# Altium project DD_Current_Sensing_Vedha.PrjPcb
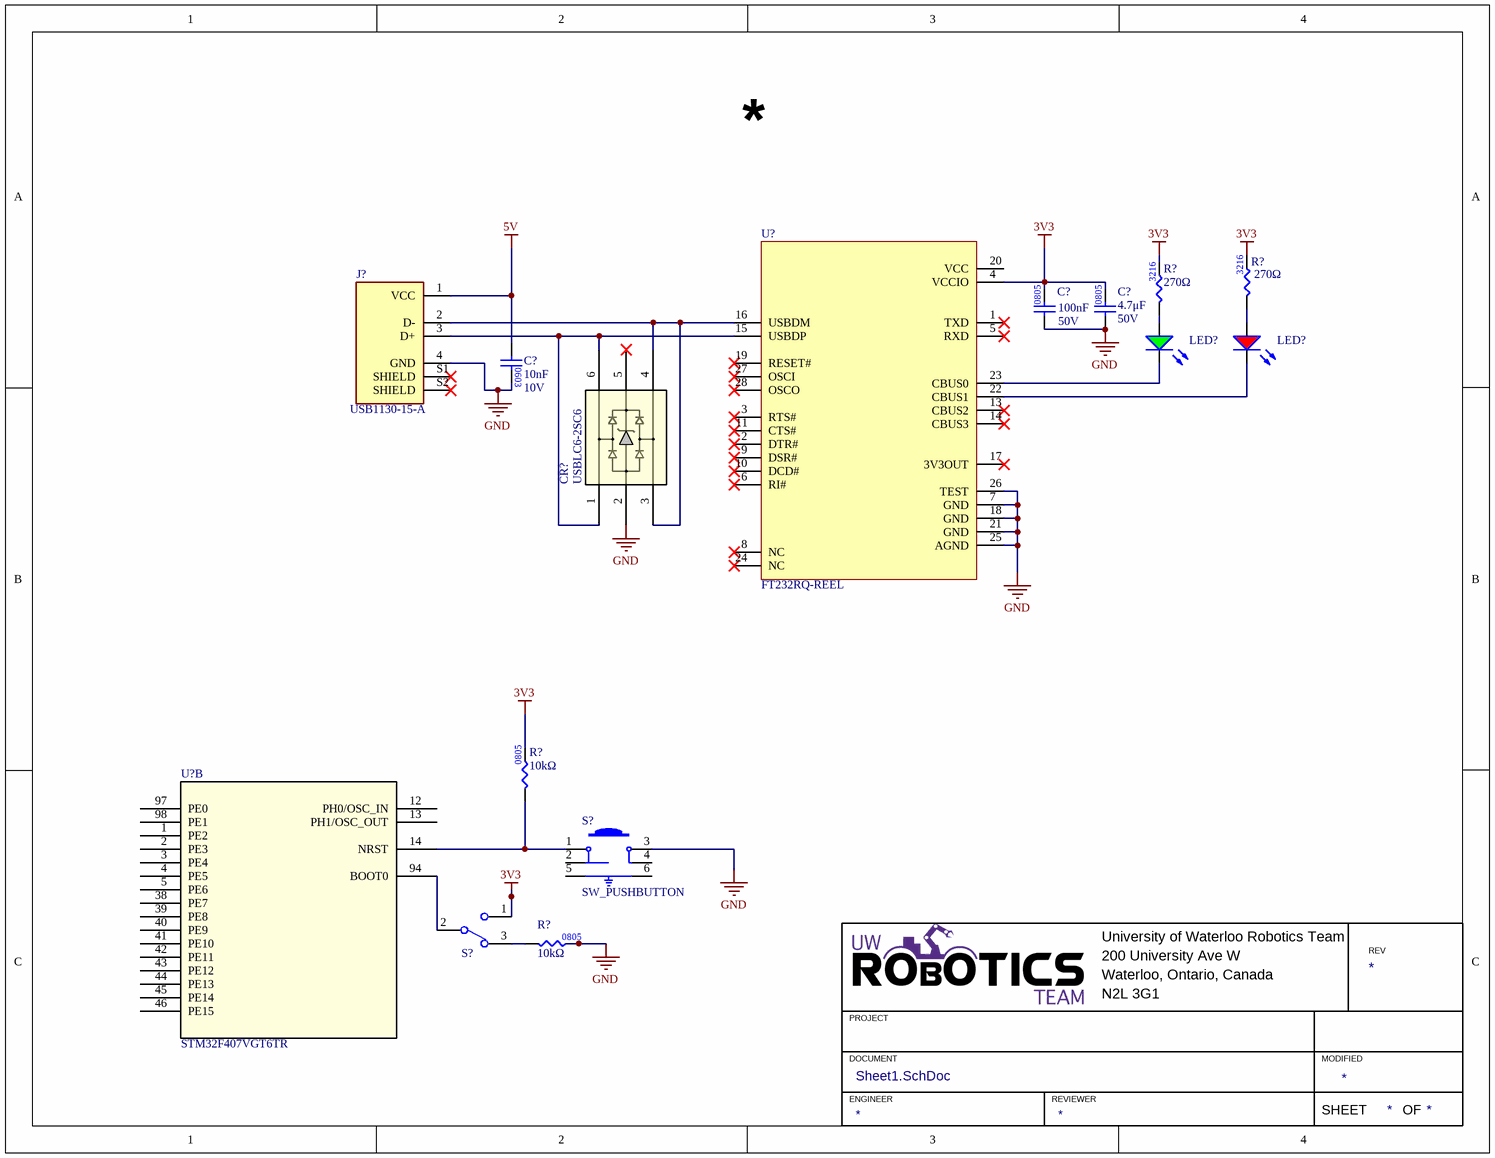
[diagram p0: Sheet1.SchDoc]
designer: Logan Hartford; reviewer: Ari Wasch; total sheets: 6; version: 6.0
5 sheets, 75 parts. Net scope: global (net labels, ports and power ports of the same name join across sheets).
Sheets:
  Sheet1.SchDoc
  Sheet2.SchDoc
  buck_converter.SchDoc
  Sheet3.SchDoc
  5V_to_3V3_Regulator.SchDoc

## Sheet Sheet1.SchDoc
size 279 x 215 mm

### Parts
(Parts that share a designator on the sheet are numbered #1, #2 ... from top to bottom, then left to right.)
C?#1  value 100nF  Voltage Rating: 50V  [CAP0805]  (hidden comment: CAP_100nF_50V_0805)
C?#2  value 4.7μF  Voltage Rating: 50V  [CAP0805]  (hidden comment: CAP_4.7uF_50V_0805)
C?#3  value 10nF  Voltage Rating: 10V  [CAP0603]  (hidden comment: CAP_10nF_25V_0603)
CR?  USBLC6-2SC6  [SOT23-6L_STM]
J?  Manufacturer Part Number 1: USB1130-15-A  [USB-A 2.0 Connector - 3d ver]  (hidden comment: USB-A 2.0 Connector)
LED?#1  LED_RED  [LED_0805_RED]  (value not drawn)
LED?#2  LED_GREEN  [LED_0805_GREEN]  (value not drawn)
R?#1  value 270Ω  [RES1206]  (hidden comment: Res_270_Ohms)
R?#2  value 270Ω  [RES1206]  (hidden comment: Res_270_Ohms)
R?#3  value 10kΩ  [RES0805]  (hidden comment: RES_10kΩ_0805_5%)
R?#4  value 10kΩ  [RES0805]  (hidden comment: RES_10kΩ_0805_5%)
S?#1  SW_PUSHBUTTON  [TACTILE_SWITCH_SMD]
S?#2  SW_TOGGLE_SPDT  [100SP1T1B4M2QE]  (value not drawn)
U?#1  FT232RQ-REEL  [FT232RQ-REEL_FTD]
U?#2  STM32F407VGT6TR  [LQFP100-14x14mm]  (part B of 3)

### Nets
3V3: C?#1.2 C?#2.2 R?#1.2 R?#2.2 R?#3.2 S?#2.1 U?#1.4(VCCIO)
5V: C?#3.1 J?.1(VCC)
GND: C?#1.1 C?#2.1 C?#3.2 CR?.2 J?.4(GND) R?#4.2 S?#1.3 U?#1.7(GND) U?#1.18(GND) U?#1.21(GND) U?#1.25(AGND) U?#1.26(TEST)
NetCR?_1: CR?.1 CR?.6 J?.3(D+) U?#1.15(USBDP)
NetCR?_3: CR?.3 CR?.4 J?.2(D-) U?#1.16(USBDM)
NetLED?#1_1: LED?#1.1(A) R?#1.1
NetLED?#1_2: LED?#1.2(K) U?#1.22(CBUS1)
NetLED?#2_1: LED?#2.1(A) R?#2.1
NetLED?#2_2: LED?#2.2(K) U?#1.23(CBUS0)
NetR?#3_1: R?#3.1 S?#1.1 U?#2.14(NRST)
NetR?#4_1: R?#4.1 S?#2.3
NetS?#2_2: S?#2.2 U?#2.94(BOOT0)

Not connected (* = marked no-connect by the designer): CR? 5*; J? S1(SHIELD)* S2(SHIELD)*; S?#1 2 4 5 6; U?#1 1(TXD)* 2(DTR#)* 3(RTS#)* 5(RXD)* 6(RI#)* 8(NC)* 9(DSR#)* 10(DCD#)* 11(CTS#)* 13(CBUS2)* 14(CBUS3)* 17(3V3OUT)* 19(RESET#)* 20(VCC) 24(NC)* 27(OSCI)* 28(OSCO)*; U?#2 1(PE2) 2(PE3) 3(PE4) 4(PE5) 5(PE6) 12(PH0/OSC_IN) 13(PH1/OSC_OUT) 38(PE7) 39(PE8) 40(PE9) 41(PE10) 42(PE11) 43(PE12) 44(PE13) 45(PE14) 46(PE15) 97(PE0) 98(PE1)

### Notes on the sheet
- University of Waterloo Robotics Team
- 200 University Ave W
- REV
- PROJECT
- Waterloo, Ontario, Canada
- N2L 3G1
- DOCUMENT
- ENGINEER
- REVIEWER
- MODIFIED
- SHEET
- OF
- (in symbol CAP_10nF_25V_0603) 0603
- (in symbol Res_270_Ohms) 3216

### Library data of the parts
C?#1 = CAP_100nF_50V_0805: CAP CER 0.1UF 50V X7R 0805; Manufacturer 1: Samsung Electro-Mechanics; Manufacturer Part Number 1: CL21B104KBCNNNC; Package/Footprint: 0805; Supplier 1: Digi-Key; Supplier Part Number 1: 1276-1003-1-ND
C?#2 = CAP_4.7uF_50V_0805: CAP CER 4.7UF 50V X5R 0805; Manufacturer 1: TDK Corporation; Manufacturer Part Number 1: CGA4J3X5R1H475K125AB; Mounting Type: SMD; Supplier 1: Digi-Key; Supplier Part Number 1: 445-7882-1-ND; Package: 0805; LCSC Part #: C1779; Dielectric: X5R
C?#3 = CAP_10nF_25V_0603: CAP CER 10000PF 25V C0G 0603; Manufacturer Part Number 1: C1608C0G1E103J080AA; Manufacturer 1: Yageo; Supplier Part Number 1: 445-2664-1-ND; Supplier 1: Digi-Key; Dielectric: C0G
CR? = USBLC6-2SC6: 17V Clamp 5A (8/20µs) Ipp Tvs Diode Surface Mount SOT-23-6; Mfr_Name: STMicroelectronics; RefDes: RefDes; Type: Type; Supplier 1: Mouser; Supplier Part Number 1: 511-USBLC6-2SC6
J? = USB-A 2.0 Connector: USB-A (USB TYPE-A) USB 2.0 Receptacle Connector 4 Position Through Hole, Right Angle; Manufacturer 1: GCT; Supplier 1: Digi-Key; Supplier Part Number 1: 2073-USB1130-15-ACT-ND
LED?#1 = LED_RED: LED RED DIFFUSED 0805 SMD; Manufacturer 1: OSRAM; Manufacturer Part Number 1: LS R976-NR-1; Package/Footprint: 0805; Forward Voltage Drop: 2V; Forward Current: 20mA; Supplier Part Number 1: 475-1278-1-ND; Supplier 1: Digi-Key; Mounting Type: SMD
LED?#2 = LED_GREEN: LED GREEN DIFFUSED 0805 SMD; Manufacturer 1: OSRAM; Manufacturer Part Number 1: LG R971-KN-1; Forward Voltage Drop: 2.2V; Package/Footprint: 0805; Supplier Part Number 1: 475-1410-1-ND; Supplier 1: Digi-Key; Mounting Type: SMD
R?#1 R?#2 = Res_270_Ohms: 270 Ohms ±5% 0.25W, 1/4W Chip Resistor 1206 (3216 Metric) Moisture Resistant Thick Film; Manufacturer Part Number 1: RC0402FR-0786K6L; Manufacturer 1: Yageo; Power: 0.063W, 1/16W; Tolerance: 1%; Package/Footprint: 0402; Supplier 1: Digi-Key; Supplier Part Number 1: YAG3249CT-ND; Mounting Type: SMD
R?#3 R?#4 = RES_10kΩ_0805_5%: RES 10K OHM 5% 1/8W 0805; Manufacturer 1: Panasonic Electronic Components; Manufacturer Part Number 1: ERJ-6GEYJ103V; Package/Footprint: 0805; Supplier 1: Digi-Key; Supplier Part Number 1: P10KACT-ND; LCSC Part #: C17414; Mounting Type: SMD
S?#1 = SW_PUSHBUTTON: SMT 3.0 X 2.6 MM TACT SWITCH WIT; Manufacturer 1: Würth Elektronik; Manufacturer Part Number 1: 435151014824; Supplier 1: Digi-Key; Supplier Part Number 1: 732-435151014824CT-ND
S?#2 = SW_TOGGLE_SPDT: SWITCH TOGGLE SPDT 5A 120V; Manufacturer 1: E-Switch; Voltage Rating (DC): 28V; Package/Footprint: TH; Supplier 1: Digi-Key; Mounting Type: TH; Throw Configuration: SPDT; Supplier Part Number 1: EG2355-ND; Manufacturer Part Number 1: 100SP1T1B4M2QE
U?#1 = FT232RQ-REEL: USB Bridge, USB to UART USB 2.0 UART Interface 32-QFN (5x5); Manufacturer: FTDI; Max Frequency: 48MHz; Package Equivalence Code: LCC32,.2SQ,20; Max Supply Voltage: 5.25V; Min Supply Voltage: 3.3V; Max Supply Current: 100uA; Qualification Status: Not Qualified; Supplier 1: Digi-Key; Supplier Part Number 1: 768-1008-1-ND; RoHS: Yes; Category: Interface ICs; Pricing 1: 1=4.70000, 10=4.25000, 50=4.05000, 100=3.85000, 250=3.45000, 500=3.05000, 1000=2.85002, 2500=2.55001 (USD); Package Code: HVQCCN; Number of Pins: 32; Package Shape: Square; Min Operating Temperature: -40°C; Max Operating Temperature: 85°C; JESD-30 Code: S-XQCC-N32; Moisture Sensitivity Level: 3; Package Style: CHIP CARRIER, HEAT SINK/SLUG, VERY THIN PROFILEMeter; Surface Mount: Yes; Technology: CMOS; Terminal Form: No Lead; Terminal Position: QUAD; Length: 5mm; Width: 5mm; Height - Seated (Max): 1mm; Terminal Pitch: 0.5mm; Temperature Grade: INDUSTRIAL; REACH SVHC: Yes; RoHS Compliant: Yes; ComponentLink1URL: https://datasheet.ciiva.com:443/pdfs/VipMasterIC/IC/FTDI/FTDI-S-A0007980421/FTDI-S-A0007980421-1.pdf?src-supplier=IHS+Markit; ComponentLink1Description: https://datasheet.ciiva.com:443/pdfs/VipMasterIC/IC/FTDI/FTDI-S-A0007980421/FTDI-S-A0007980421-1.pdf?src-supplier=IHS+Markit; ComponentLink2URL: https://datasheet.ciiva.com/1505/1647396-1505445.pdf?src-supplier=Digi-Key; ComponentLink2Description: https://datasheet.ciiva.com/1505/1647396-1505445.pdf?src-supplier=Digi-Key; ComponentLink3URL: https://datasheet.ciiva.com/26841/ft232rq-reel-26841082.pdf?src-supplier=IIIC; ComponentLink3Description: https://datasheet.ciiva.com/26841/ft232rq-reel-26841082.pdf?src-supplier=IIIC; ComponentLink4URL: https://datasheet.ciiva.com/16438/ds-ft232r-16438555.pdf?src-supplier=Future+Electronics; ComponentLink4Description: https://datasheet.ciiva.com/16438/ds-ft232r-16438555.pdf?src-supplier=Future+Electronics; ComponentLink5URL: https://datasheet.ciiva.com/15150/getdatasheetpartid-644721-15150509.pdf?src-supplier=Verical; ComponentLink5Description: https://datasheet.ciiva.com/15150/getdatasheetpartid-644721-15150509.pdf?src-supplier=Verical; ComponentLink6URL: https://datasheet.ciiva.com/4787/ds-ft232r-4787663.pdf?src-supplier=Mouser; ComponentLink6Description: https://datasheet.ciiva.com/4787/ds-ft232r-4787663.pdf?src-supplier=Mouser; ComponentLink7URL: https://datasheet.ciiva.com/1787/ds-ft232r-1787041.pdf?src-supplier=Digi-Key; ComponentLink7Description: https://datasheet.ciiva.com/1787/ds-ft232r-1787041.pdf?src-supplier=Digi-Key; ComponentLink8URL: https://datasheet.ciiva.com/1787/ds-ft232r-1787042.pdf?src-supplier=Digi-Key; ComponentLink8Description: https://datasheet.ciiva.com/1787/ds-ft232r-1787042.pdf?src-supplier=Digi-Key; Manufacturer Part Number: FT232RQ-REEL
U?#2 = STM32F407VGT6TR: ARM® Cortex®-M4 STM32F4 Microcontroller IC 32-Bit Single-Core 168MHz 1MB (1M x 8) FLASH 100-LQFP (14x14); Mfr_Name: STMicroelectronics; Connectivity: CANbus, DCMI, EBI/EMI, Ethernet, I2C, IrDA, LINbus, SPI, UART/USART, USB OTG; Peripherals: Brown-out Detect/Reset, DMA, I2S, LCD, POR, PWM, WDT; Core Processor: ARM® Cortex®-M4; Core Size: 32-Bit Single-Core; Supplier Device Package: 100-LQFP (14x14)

## Sheet Sheet2.SchDoc
size 279 x 215 mm
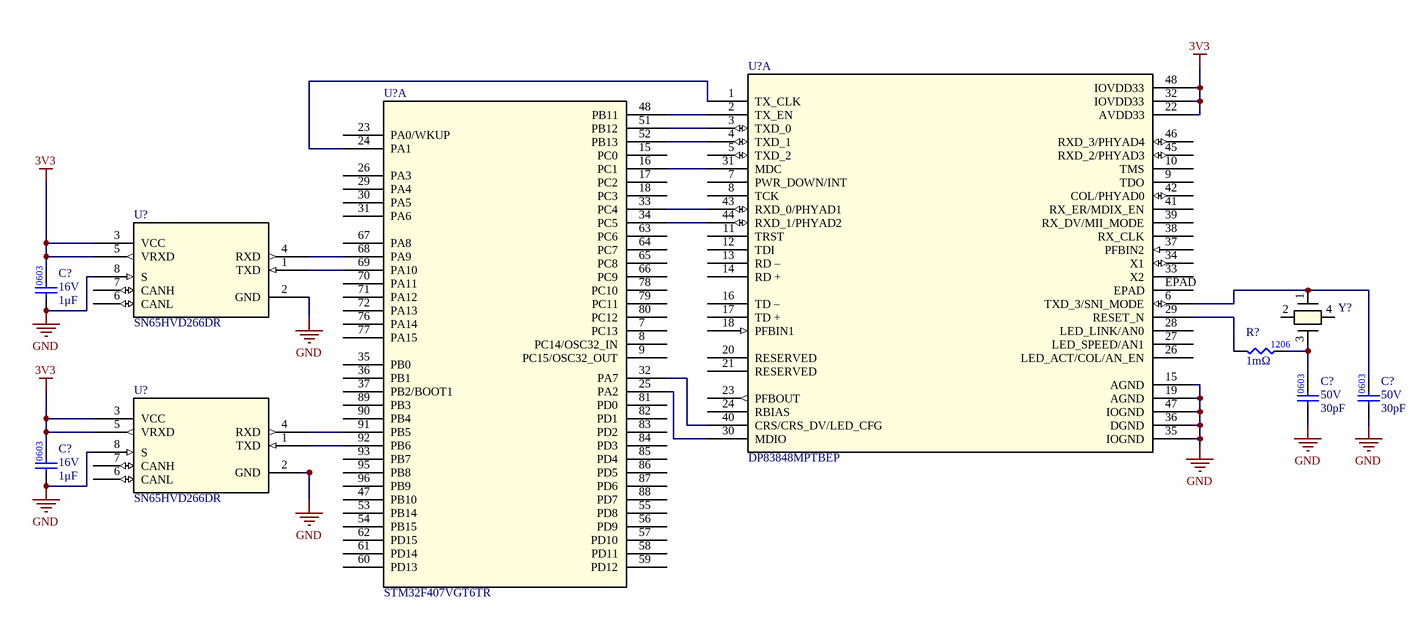
[diagram p1: Sheet2.SchDoc]

### Parts
(Parts that share a designator on the sheet are numbered #1, #2 ... from top to bottom, then left to right.)
C?#4  value 1μF  Voltage Rating: 16V  [CAP0603]  (hidden comment: CAP_1uF_16V_0603)
C?#5  value 30pF  Voltage Rating: 50V  [CAP0603]  (hidden comment: CAP_30pF_50V_0603_1)
C?#6  value 30pF  Voltage Rating: 50V  [CAP0603]  (hidden comment: CAP_30pF_50V_0603_1)
C?#7  value 1μF  Voltage Rating: 16V  [CAP0603]  (hidden comment: CAP_1uF_16V_0603)
R?#5  value 1mΩ  [RESC3116X65N]  (hidden comment: RES_1mΩ_1206_1%)
U?#3  DP83848MPTBEP  [QFP_PTBEP_TEX]  (part A of 2)
U?#4  STM32F407VGT6TR  [LQFP100-14x14mm]  (part A of 3)
U?#5  SN65HVD266DR  [D8_TEX]
U?#6  SN65HVD266DR  [D8_TEX]
Y?  ABM3C-25.000MHZ-D4Y-T  [CRYSTAL_ABM3C_ABR]  (value not drawn)

### Nets
3V3: C?#4.2 C?#7.2 U?#3.22(AVDD33) U?#3.32(IOVDD33) U?#3.48(IOVDD33) U?#5.3(VCC) U?#5.5(VRXD) U?#6.3(VCC) U?#6.5(VRXD)
GND: C?#4.1 C?#5.1 C?#6.1 C?#7.1 U?#3.15(AGND) U?#3.19(AGND) U?#3.35(IOGND) U?#3.36(DGND) U?#3.47(IOGND) U?#5.2(GND) U?#5.8(S) U?#6.2(GND) U?#6.8(S)
NetC?#5_2: C?#5.2 R?#5.2 Y?.3
NetC?#6_2: C?#6.2 U?#3.6(TXD_3/SNI_MODE) Y?.1
NetR?#5_1: R?#5.1 U?#3.29(RESET_N)
NetU?#3_1: U?#3.1(TX_CLK) U?#4.24(PA1)
NetU?#3_2: U?#3.2(TX_EN) U?#4.48(PB11)
NetU?#3_3: U?#3.3(TXD_0) U?#4.51(PB12)
NetU?#3_4: U?#3.4(TXD_1) U?#4.52(PB13)
NetU?#3_30: U?#3.30(MDIO) U?#4.25(PA2)
NetU?#3_31: U?#3.31(MDC) U?#4.16(PC1)
NetU?#3_40: U?#3.40(CRS/CRS_DV/LED_CFG) U?#4.32(PA7)
NetU?#3_43: U?#3.43(RXD_0/PHYAD1) U?#4.33(PC4)
NetU?#3_44: U?#3.44(RXD_1/PHYAD2) U?#4.34(PC5)
NetU?#4_68: U?#4.68(PA9) U?#5.4(RXD)
NetU?#4_69: U?#4.69(PA10) U?#5.1(TXD)
NetU?#4_91: U?#4.91(PB5) U?#6.4(RXD)
NetU?#4_92: U?#4.92(PB6) U?#6.1(TXD)

Not connected (* = marked no-connect by the designer): U?#3 5(TXD_2) 7(PWR_DOWN/INT) 8(TCK) 9(TDO) 10(TMS) 11(TRST) 12(TDI) 13(RD_–) 14(RD_+) 16(TD_–) 17(TD_+) 18(PFBIN1) 20(RESERVED) 21(RESERVED) 23(PFBOUT) 24(RBIAS) 26(LED_ACT/COL/AN_EN) 27(LED_SPEED/AN1) 28(LED_LINK/AN0) 33(X2) 34(X1) 37(PFBIN2) 38(RX_CLK) 39(RX_DV/MII_MODE) 41(RX_ER/MDIX_EN) 42(COL/PHYAD0) 45(RXD_2/PHYAD3) 46(RXD_3/PHYAD4) EPAD; U?#4 7(PC13) 8(PC14/OSC32_IN) 9(PC15/OSC32_OUT) 15(PC0) 17(PC2) 18(PC3) 23(PA0/WKUP) 26(PA3) 29(PA4) 30(PA5) 31(PA6) 35(PB0) 36(PB1) 37(PB2/BOOT1) 47(PB10) 53(PB14) 54(PB15) 55(PD8) 56(PD9) 57(PD10) 58(PD11) 59(PD12) 60(PD13) 61(PD14) 62(PD15) 63(PC6) 64(PC7) 65(PC8) 66(PC9) 67(PA8) 70(PA11) 71(PA12) 72(PA13) 76(PA14) 77(PA15) 78(PC10) 79(PC11) 80(PC12) 81(PD0) 82(PD1) 83(PD2) 84(PD3) 85(PD4) 86(PD5) 87(PD6) 88(PD7) 89(PB3) 90(PB4) 93(PB7) 95(PB8) 96(PB9); U?#5 6(CANL) 7(CANH); U?#6 6(CANL) 7(CANH); Y? 2 4

### Notes on the sheet
- University of Waterloo Robotics Team
- 200 University Ave W
- REV
- PROJECT
- Waterloo, Ontario, Canada
- N2L 3G1
- DOCUMENT
- ENGINEER
- REVIEWER
- MODIFIED
- SHEET
- OF
- (in symbol CAP_30pF_50V_0603_1) 0603

### Library data of the parts
C?#4 C?#7 = CAP_1uF_16V_0603: CAP CER 1UF 16V Y5V 0603; Manufacturer 1: Yageo; Manufacturer Part Number 1: CC0603ZRY5V7BB105; Supplier Part Number 1: 311-1372-1-ND; Supplier 1: Digi-Key; Mounting Type: SMD; Package: 0603; Dielectric: Y5V
C?#5 C?#6 = CAP_30pF_50V_0603_1: 30 pF ±5% 50V Ceramic Capacitor C0G, NP0 0603 (1608 Metric); Manufacturer Part Number 1: GCM188R71C334KA37D; Manufacturer 1: Murata Electronics North America; Dielectric: X7R; Supplier 1: Digikey; Supplier Part Number 1: 478-7917-1-ND
R?#5 = RES_1mΩ_1206_1%: RES 0.001 OHM 1% 1W 1206; Manufacturer 1: Delta Electronics/Cyntec; Manufacturer Part Number 1: RL1632T4F-R001-FNH; Package/Footprint: 1206; Mounting Type: SMD; Supplier 1: Digi-Key; Supplier Part Number 1: 2037-RL1632T4F-R001-FNHCT-ND
U?#3 = DP83848MPTBEP: No Description Available; Mfr_Name: Texas Instruments; RefDes: RefDes; Type: Type
U?#4 = STM32F407VGT6TR: as U?#2 on sheet Sheet1; Core Processor: ARM® Cortex®-M4; Core Size: 32-Bit Single-Core; Supplier Device Package: 100-LQFP (14x14)
U?#5 U?#6 = SN65HVD266DR: No Description Available; Mfr_Name: Texas Instruments; RefDes: RefDes; Type: Type
Y? = ABM3C-25.000MHZ-D4Y-T: No Description Available; Mfr_Name: Abracon

## Sheet buck_converter.SchDoc
size 279 x 215 mm
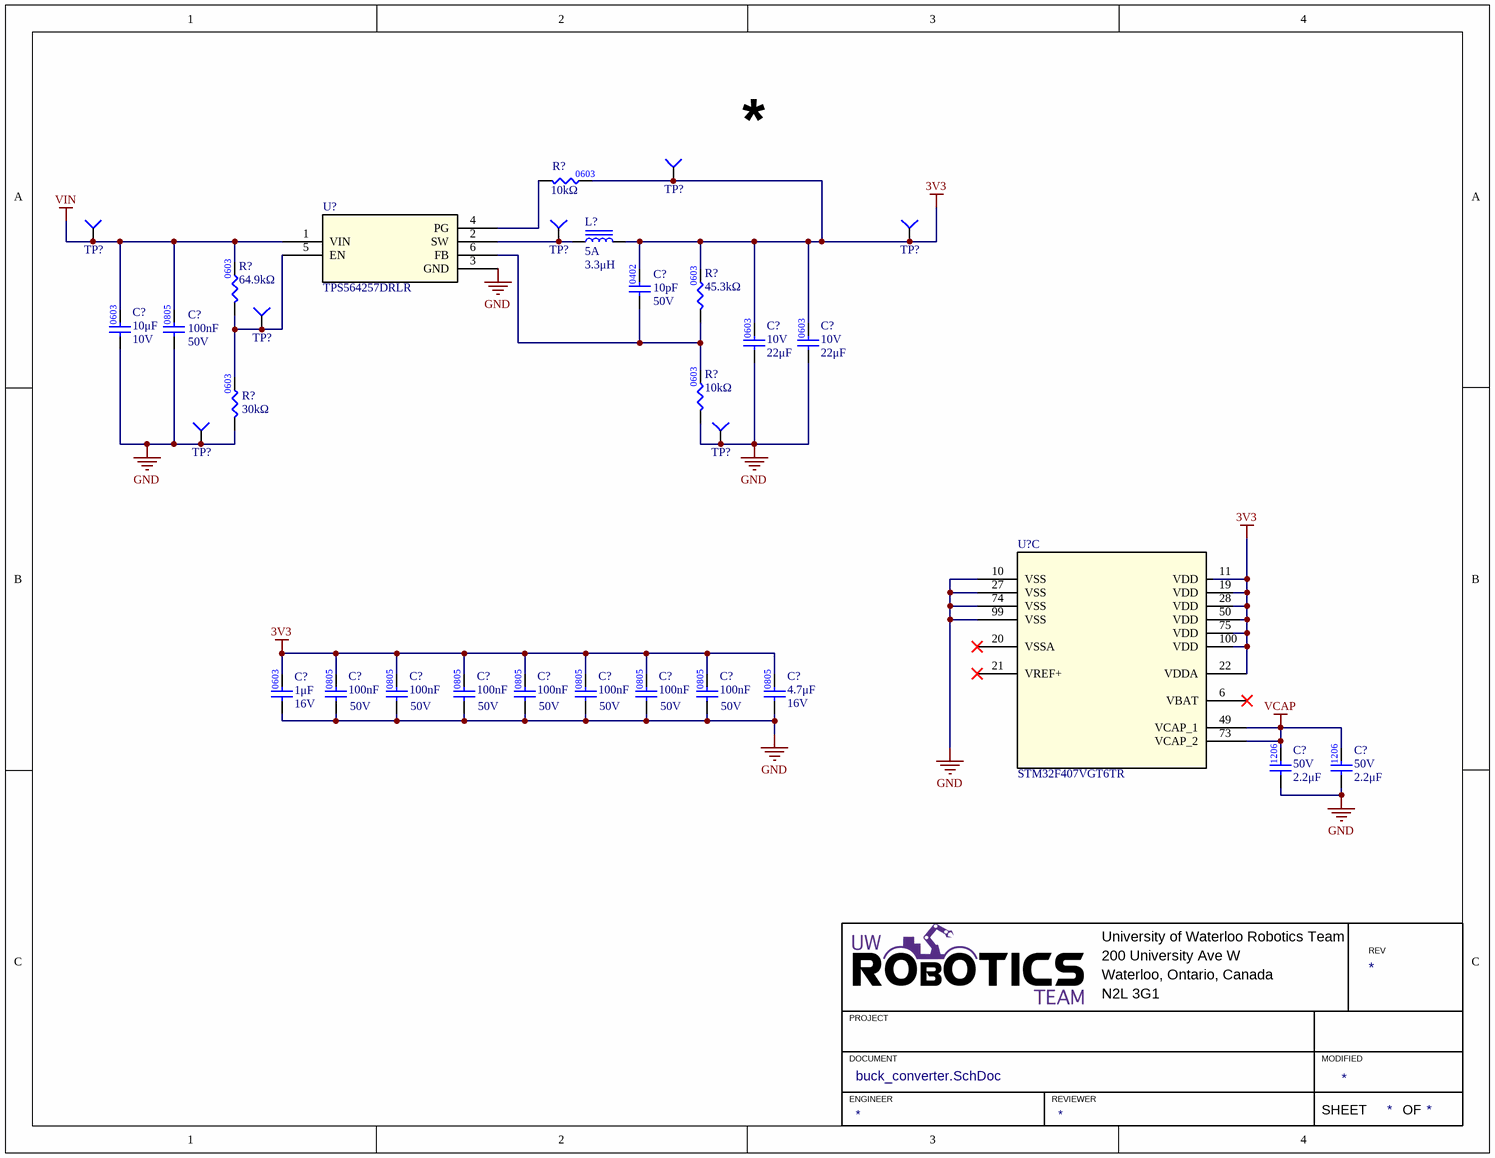
[diagram p2: buck_converter.SchDoc]

### Parts
(Parts that share a designator on the sheet are numbered #1, #2 ... from top to bottom, then left to right.)
C?#8  value 10pF  Voltage Rating: 50V  [CAP0402]  (hidden comment: CAP_10pF_50V_0402)
C?#9  value 10μF  Voltage Rating: 10V  [CAP0603]  (hidden comment: CAP_10uF_10V_0603)
C?#10  value 100nF  Voltage Rating: 50V  [CAP0805]  (hidden comment: CAP_100nF_50V_0805)
C?#11  value 22μF  Voltage Rating: 10V  [CAP0603]  (hidden comment: CAP_22uF_10V_0603)
C?#12  value 22μF  Voltage Rating: 10V  [CAP0603]  (hidden comment: CAP_22uF_10V_0603)
C?#13  value 1μF  Voltage Rating: 16V  [CAP0603]  (hidden comment: CAP_1uF_16V_0603)
C?#14  value 100nF  Voltage Rating: 50V  [CAP0805]  (hidden comment: CAP_100nF_50V_0805)
C?#15  value 100nF  Voltage Rating: 50V  [CAP0805]  (hidden comment: CAP_100nF_50V_0805)
C?#16  value 100nF  Voltage Rating: 50V  [CAP0805]  (hidden comment: CAP_100nF_50V_0805)
C?#17  value 100nF  Voltage Rating: 50V  [CAP0805]  (hidden comment: CAP_100nF_50V_0805)
C?#18  value 100nF  Voltage Rating: 50V  [CAP0805]  (hidden comment: CAP_100nF_50V_0805)
C?#19  value 100nF  Voltage Rating: 50V  [CAP0805]  (hidden comment: CAP_100nF_50V_0805)
C?#20  value 100nF  Voltage Rating: 50V  [CAP0805]  (hidden comment: CAP_100nF_50V_0805)
C?#21  value 4.7μF  Voltage Rating: 16V  [CAP0805]  (hidden comment: CAP_4.7uF_16V_0805)
C?#22  value 2.2μF  Voltage Rating: 50V  [CAP1206]  (hidden comment: CAP_2.2uF_50V_1206)
C?#23  value 2.2μF  Voltage Rating: 50V  [CAP1206]  (hidden comment: CAP_2.2uF_50V_1206)
L?#1  Current Rating: 5A  Inductance: 3.3μH  [IND_SRN6045TA-3R3Y]  (hidden comment: IND_3.3uH_5A)
R?#6  value 10kΩ  [RES0603]  (hidden comment: RES_10kΩ_0603_5%)
R?#7  Resistance: 64.9kΩ  [RES1210]  (hidden comment: RES 64.9K OHM 1% 1/10W 0603)
R?#8  Resistance: 45.3kΩ  [RES1210]  (hidden comment: RES 45.3K OHM 1% 1/10W 0603)
R?#9  value 10kΩ  [RES0603]  (hidden comment: RES_10kΩ_0603_5%)
R?#10  value 30kΩ  [RES0603]  (hidden comment: RES_30kΩ_0603_0.5%)
TP?#1  TESTPOINT_SMD_LOOP  [S1751-46R]  (value not drawn)
TP?#2  TESTPOINT_SMD_LOOP  [S1751-46R]  (value not drawn)
TP?#3  TESTPOINT_SMD_LOOP  [S1751-46R]  (value not drawn)
TP?#4  TESTPOINT_SMD_LOOP  [S1751-46R]  (value not drawn)
TP?#5  TESTPOINT_SMD_LOOP  [S1751-46R]  (value not drawn)
TP?#6  TESTPOINT_SMD_LOOP  [S1751-46R]  (value not drawn)
TP?#7  TESTPOINT_SMD_LOOP  [S1751-46R]  (value not drawn)
U?#7  TPS564257DRLR  [TPS564242DRLR_TEX]
U?#8  STM32F407VGT6TR  [LQFP100-14x14mm]  (part C of 3)

### Nets
3V3: C?#8.2 C?#11.2 C?#12.2 C?#13.2 C?#14.2 C?#15.2 C?#16.2 C?#17.2 C?#18.2 C?#19.2 C?#20.2 C?#21.2 L?#1.2 R?#6.2 R?#8.2 TP?#1.1(=value) TP?#4.1(=value) U?#8.11(VDD) U?#8.19(VDD) U?#8.22(VDDA) U?#8.28(VDD) U?#8.50(VDD) U?#8.75(VDD) U?#8.100(VDD)
GND: C?#9.1 C?#10.1 C?#11.1 C?#12.1 C?#13.1 C?#14.1 C?#15.1 C?#16.1 C?#17.1 C?#18.1 C?#19.1 C?#20.1 C?#21.1 C?#22.1 C?#23.1 R?#9.1 R?#10.1 TP?#6.1(=value) TP?#7.1(=value) U?#7.3(GND) U?#8.10(VSS) U?#8.27(VSS) U?#8.74(VSS) U?#8.99(VSS)
VCAP: C?#22.2 C?#23.2 U?#8.49(VCAP_1) U?#8.73(VCAP_2)
VIN: C?#9.2 C?#10.2 R?#7.2 TP?#2.1(=value) U?#7.1(VIN)
NetC?#8_1: C?#8.1 R?#8.1 R?#9.2 U?#7.6(FB)
NetL?#1_1: L?#1.1 TP?#3.1(=value) U?#7.2(SW)
NetR?#6_1: R?#6.1 U?#7.4(PG)
NetR?#7_1: R?#7.1 R?#10.2 TP?#5.1(=value) U?#7.5(EN)

Not connected (* = marked no-connect by the designer): U?#8 6(VBAT)* 20(VSSA)* 21(VREF+)*

### Notes on the sheet
- University of Waterloo Robotics Team
- 200 University Ave W
- REV
- PROJECT
- Waterloo, Ontario, Canada
- N2L 3G1
- DOCUMENT
- ENGINEER
- REVIEWER
- MODIFIED
- SHEET
- OF
- (in symbol CAP_2.2uF_50V_1206) 1206
- (in symbol CAP_10uF_10V_0603) 0603

### Library data of the parts
C?#8 = CAP_10pF_50V_0402: CAP CER 10PF 50V C0G/NPO 0402; Manufacturer 1: Yageo; Package: 0402; Supplier 1: Digi-Key; Supplier Part Number 1: 311-1014-1-ND; Manufacturer Part Number 1: CAP CER 10PF 50V C0G/NPO 0402
C?#9 = CAP_10uF_10V_0603: CAP CER 10UF 10V X5R 0603; Manufacturer Part Number 1: CC0603MRX5R6BB106; Manufacturer 1: Yageo; Supplier Part Number 1: 311-1817-1-ND; Supplier 1: Digi-Key; Dielectric: X5R
C?#10 C?#14-C?#20 = CAP_100nF_50V_0805: as C?#1 on sheet Sheet1; Supplier 1: Digi-Key; Supplier Part Number 1: 1276-1003-1-ND
C?#11 C?#12 = CAP_22uF_10V_0603: CAP CER 22UF 10V X5R 0603; Manufacturer: Taiyo Yuden; Manufacturer Part Number: LMK107BBJ226MA-T; Supplier 1: Digi-Key; Supplier Part Number 1: 587-4913-1-ND; Package: 0603
C?#13 = CAP_1uF_16V_0603: as C?#4 on sheet Sheet2; Supplier Part Number 1: 311-1372-1-ND; Supplier 1: Digi-Key; Mounting Type: SMD; Package: 0603; Dielectric: Y5V
C?#21 = CAP_4.7uF_16V_0805: CAP CER 4.7UF 16V X5R 0805; Manufacturer 1: Samsung Electro-Mechanics; Manufacturer Part Number 1: CL21A475KOFNNNE; Mounting Type: SMD; Supplier 1: Digi-Key; Supplier Part Number 1: 1276-1065-1-ND; Package: 0805; LCSC Part #: C1779; Dielectric: X5R
C?#22 C?#23 = CAP_2.2uF_50V_1206: CAP CER 2.2UF 50V X7R 1206; Manufacturer 1: Murata Electronics; Manufacturer Part Number 1: GCM31CR71H225KA55L; Supplier Part Number 1: 490-4796-1-ND; Supplier 1: Digi-Key; Dielectric: X7R
L?#1 = IND_3.3uH_5A: INDUCTOR 3.3UH 5A 21 MOHM SMD; Manufacturer 1: Bourns Inc.; Manufacturer Part Number 1: SRN6045TA-3R3Y; DC Resistance (DCR): 21mOhm; Inductance Tolerance: 30%; Saturation Current: 7.8A; Test Frequency: 1MHz; Mounting Type: SMD; Supplier 1: Digi-Key; Supplier Part Number 1: SRN6045TA-3R3YCT-ND
R?#6 R?#9 = RES_10kΩ_0603_5%: RES 10K OHM 5% 1/10W 0603; Manufacturer 1: Yageo; Manufacturer Part Number 1: RC0603JR-0710KL; Supplier Part Number 1: 311-10KGRCT-ND; Supplier 1: Digi-Key; Mounting Type: SMD; Package: 0603
R?#7 = RES 64.9K OHM 1% 1/10W 0603: Manufacturer 1: YAGEO; Manufacturer Part Number 1: RC0603FR-0764K9L; Supplier 1: Digi-Key; Mounting Type: SMD; Tolerance: 1%; Supplier Part Number 1: 311-64.9KHRTR-ND; Package: 0603
R?#8 = RES 45.3K OHM 1% 1/10W 0603: Manufacturer 1: Stackpole Electronics Inc; Manufacturer Part Number 1: RMCF0603FT45K3TR-ND; Supplier 1: Digi-Key; Mounting Type: SMD; Tolerance: 1%; Supplier Part Number 1: RMCF0603FT45K3; Package: 0603
R?#10 = RES_30kΩ_0603_0.5%: RES 30K OHM 0.5% 1/10W 0603; Manufacturer 1: Yageo; Manufacturer Part Number 1: RT0603DRD0730KL; Supplier Part Number 1: 311-30KDCT-ND; Supplier 1: Digi-Key; Package: 0603; Tolerance: 0.5%
TP?#1-TP?#7 = TESTPOINT_SMD_LOOP: TESTPOINT SMD LOOP; Manufacturer 1: Harwin; Supplier 1: Digi-Key; Manufacturer Part Number 1: S1751-46R; Mounting Type: SMD; Package/Footprint: SMD; Supplier Part Number 1: 952-1478-1-ND
U?#7 = TPS564257DRLR: Buck Switching Regulator IC Positive Adjustable 0.6V 1 Output 4A SOT-563, SOT-666; Mfr_Name: Texas Instruments; Type: Power Management; Package / Case: SOT-563, SOT-666; Supplier 1: Mouser; Supplier Part Number 1: 595-TPS564257DRLR
U?#8 = STM32F407VGT6TR: as U?#2 on sheet Sheet1; Core Processor: ARM® Cortex®-M4; Core Size: 32-Bit Single-Core; Supplier Device Package: 100-LQFP (14x14)

## Sheet Sheet3.SchDoc
size A4

## Sheet 5V_to_3V3_Regulator.SchDoc
size 279 x 215 mm
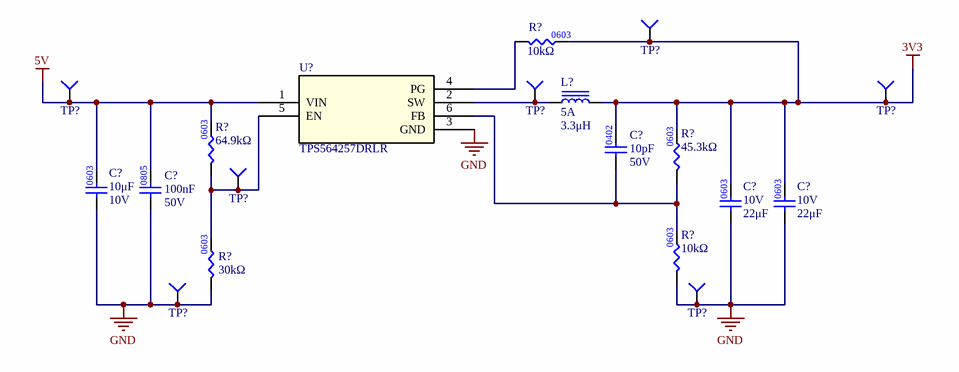
[diagram p3: 5V_to_3V3_Regulator.SchDoc]

### Parts
(Parts that share a designator on the sheet are numbered #1, #2 ... from top to bottom, then left to right.)
C?#24  value 10pF  Voltage Rating: 50V  [CAP0402]  (hidden comment: CAP_10pF_50V_0402)
C?#25  value 10μF  Voltage Rating: 10V  [CAP0603]  (hidden comment: CAP_10uF_10V_0603)
C?#26  value 100nF  Voltage Rating: 50V  [CAP0805]  (hidden comment: CAP_100nF_50V_0805)
C?#27  value 22μF  Voltage Rating: 10V  [CAP0603]  (hidden comment: CAP_22uF_10V_0603)
C?#28  value 22μF  Voltage Rating: 10V  [CAP0603]  (hidden comment: CAP_22uF_10V_0603)
L?#2  Current Rating: 5A  Inductance: 3.3μH  [IND_SRN6045TA-3R3Y]  (hidden comment: IND_3.3uH_5A)
R?#11  value 10kΩ  [RES0603]  (hidden comment: RES_10kΩ_0603_5%)
R?#12  Resistance: 64.9kΩ  [RES1210]  (hidden comment: RES 64.9K OHM 1% 1/10W 0603)
R?#13  Resistance: 45.3kΩ  [RES1210]  (hidden comment: RES 45.3K OHM 1% 1/10W 0603)
R?#14  value 10kΩ  [RES0603]  (hidden comment: RES_10kΩ_0603_5%)
R?#15  value 30kΩ  [RES0603]  (hidden comment: RES_30kΩ_0603_0.5%)
TP?#8  TESTPOINT_SMD_LOOP  [S1751-46R]  (value not drawn)
TP?#9  TESTPOINT_SMD_LOOP  [S1751-46R]  (value not drawn)
TP?#10  TESTPOINT_SMD_LOOP  [S1751-46R]  (value not drawn)
TP?#11  TESTPOINT_SMD_LOOP  [S1751-46R]  (value not drawn)
TP?#12  TESTPOINT_SMD_LOOP  [S1751-46R]  (value not drawn)
TP?#13  TESTPOINT_SMD_LOOP  [S1751-46R]  (value not drawn)
TP?#14  TESTPOINT_SMD_LOOP  [S1751-46R]  (value not drawn)
U?#9  TPS564257DRLR  [TPS564242DRLR_TEX]

### Nets
3V3: C?#24.2 C?#27.2 C?#28.2 L?#2.2 R?#11.2 R?#13.2 TP?#8.1(=value) TP?#11.1(=value)
5V: C?#25.2 C?#26.2 R?#12.2 TP?#9.1(=value) U?#9.1(VIN)
GND: C?#25.1 C?#26.1 C?#27.1 C?#28.1 R?#14.1 R?#15.1 TP?#13.1(=value) TP?#14.1(=value) U?#9.3(GND)
NetC?#24_1: C?#24.1 R?#13.1 R?#14.2 U?#9.6(FB)
NetL?#2_1: L?#2.1 TP?#10.1(=value) U?#9.2(SW)
NetR?#11_1: R?#11.1 U?#9.4(PG)
NetR?#12_1: R?#12.1 R?#15.2 TP?#12.1(=value) U?#9.5(EN)

### Notes on the sheet
- University of Waterloo Robotics Team
- 200 University Ave W
- REV
- PROJECT
- Waterloo, Ontario, Canada
- N2L 3G1
- DOCUMENT
- ENGINEER
- REVIEWER
- MODIFIED
- SHEET
- OF
- (in symbol CAP_10uF_10V_0603) 0603

### Library data of the parts
C?#24 = CAP_10pF_50V_0402: as C?#8 on sheet buck_converter; Package: 0402; Supplier 1: Digi-Key; Supplier Part Number 1: 311-1014-1-ND; Manufacturer Part Number 1: CAP CER 10PF 50V C0G/NPO 0402
C?#25 = CAP_10uF_10V_0603: as C?#9 on sheet buck_converter; Supplier Part Number 1: 311-1817-1-ND; Supplier 1: Digi-Key; Dielectric: X5R
C?#26 = CAP_100nF_50V_0805: as C?#1 on sheet Sheet1; Supplier 1: Digi-Key; Supplier Part Number 1: 1276-1003-1-ND
C?#27 C?#28 = CAP_22uF_10V_0603: as C?#11 on sheet buck_converter; Supplier 1: Digi-Key; Supplier Part Number 1: 587-4913-1-ND; Package: 0603
L?#2 = IND_3.3uH_5A: as L?#1 on sheet buck_converter; Mounting Type: SMD; Supplier 1: Digi-Key; Supplier Part Number 1: SRN6045TA-3R3YCT-ND
R?#11 R?#14 = RES_10kΩ_0603_5%: as R?#6 on sheet buck_converter; Supplier Part Number 1: 311-10KGRCT-ND; Supplier 1: Digi-Key; Mounting Type: SMD; Package: 0603
R?#12 = RES 64.9K OHM 1% 1/10W 0603: as R?#7 on sheet buck_converter; Supplier 1: Digi-Key; Mounting Type: SMD; Tolerance: 1%; Supplier Part Number 1: 311-64.9KHRTR-ND; Package: 0603
R?#13 = RES 45.3K OHM 1% 1/10W 0603: as R?#8 on sheet buck_converter; Supplier 1: Digi-Key; Mounting Type: SMD; Tolerance: 1%; Supplier Part Number 1: RMCF0603FT45K3; Package: 0603
R?#15 = RES_30kΩ_0603_0.5%: as R?#10 on sheet buck_converter; Supplier Part Number 1: 311-30KDCT-ND; Supplier 1: Digi-Key; Package: 0603; Tolerance: 0.5%
TP?#8-TP?#14 = TESTPOINT_SMD_LOOP: as TP?#1 on sheet buck_converter; Supplier 1: Digi-Key; Manufacturer Part Number 1: S1751-46R; Mounting Type: SMD; Package/Footprint: SMD; Supplier Part Number 1: 952-1478-1-ND
U?#9 = TPS564257DRLR: as U?#7 on sheet buck_converter; Type: Power Management; Package / Case: SOT-563, SOT-666; Supplier 1: Mouser; Supplier Part Number 1: 595-TPS564257DRLR

## Nets that join several sheets
3V3: Sheet1 (7 pins), Sheet2 (9 pins), buck_converter (24 pins), 5V_to_3V3_Regulator (8 pins)
5V: Sheet1 (C?#3.1 J?.1), 5V_to_3V3_Regulator (5 pins)
GND: Sheet1 (12 pins), Sheet2 (13 pins), buck_converter (24 pins), 5V_to_3V3_Regulator (9 pins)

## Assembly variants
Only Populated Components: not fitted R28 R31 R44 R47 R60 R77